# EasyEDA schematic 1-Schematic.json
TITLE: USB Port Protector; REV: 1.0; Date: 2018-06-15; Sheet: 1/1; Drawn By: tardate
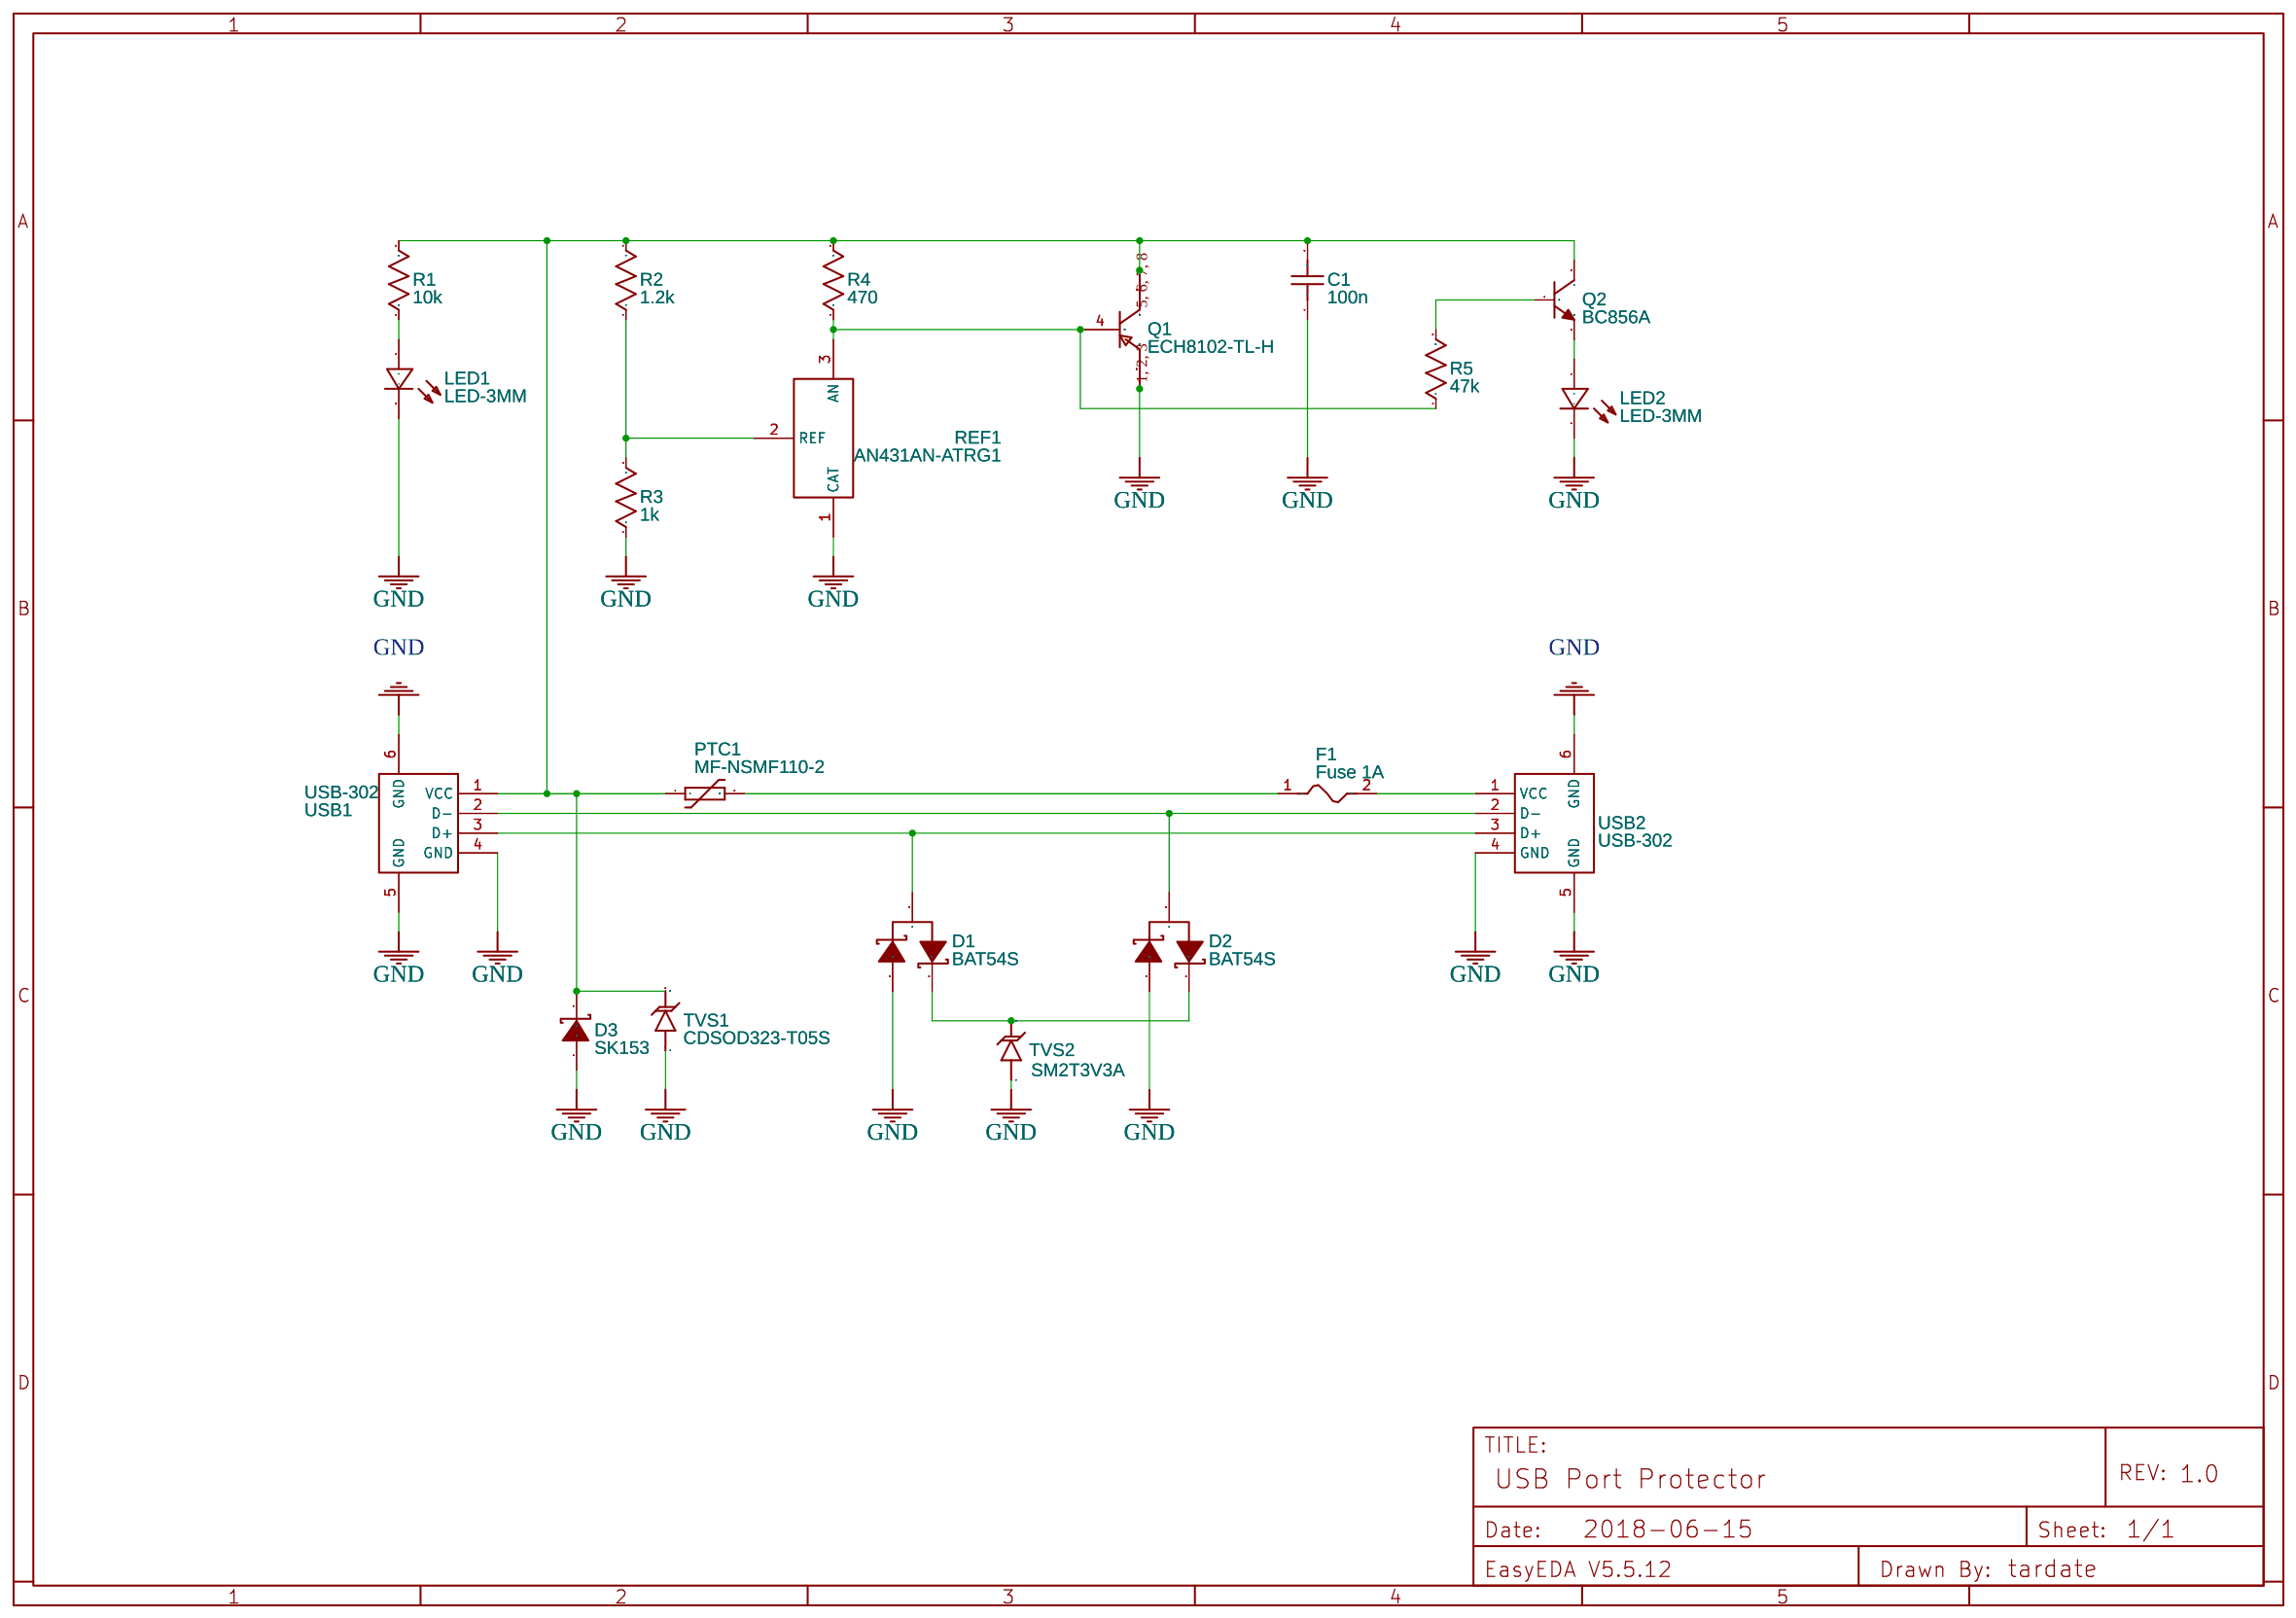
[diagram p0: schematic sheet]

## Parts
C1  100n  [RAD-0.1]
D1  BAT54S  [SOT-23(SOT-23-3)]
D2  BAT54S  [SOT-23(SOT-23-3)]
D3  SK153  [DO-16]
F1  Fuse 1A  [1206]
LED1  LED-3MM  [LED-3MM/2.54]
LED2  LED-3MM  [LED-3MM/2.54]
PTC1  MF-NSMF110-2  [PTC0805]
Q1  ECH8102-TL-H  [SOT23-8]
Q2  BC856A  [SOT-23(SOT-23-3)]
R1  10k  [AXIAL-0.3]
R2  1.2k  [AXIAL-0.3]
R3  1k  [AXIAL-0.3]
R4  470  [AXIAL-0.3]
R5  47k  [AXIAL-0.3]
REF1  AN431AN-ATRG1  [SOT-23(SOT-23-3)]
TVS1  CDSOD323-T05S  [SMC]
TVS2  SM2T3V3A  [SMC]
USB1  USB-302  [USB-302]
USB2  USB-302  [USB-302]

## Library data of the parts
C1 = Cap_RAD-0.1_US: Manufacturer Part: ?
D1 D2 = -: Supplier: LCSC; LCSC: C83935; Manufacturer: SEMTECH; image: //image.lceda.cn/szlcsc/C83935.jpg
D3 = Schottky: Manufacturer Part: ?
F1 = -: Supplier: LCSC; Manufacturer: BOURNS; Manufacturer Part: MF-NSMF110-2; LCSC: C89654
LED1 LED2 = -: Supplier: LCSC; Manufacturer: EVERLIGHT; Manufacturer Part: 204-10UYC/S530-A3
PTC1 = -: Resettable PTC; Contributor: DangerousPrototype; Manufacturer Part: ?
Q1 = -: Bipolar Transistor, -30 V, -12 A, Low VCE(sat), PNP Single, 8-Pin SOT-28FL, Pb-Free, Tape and Reel; Manufacturer Part: ?
Q2 = -: Supplier: LCSC; Manufacturer: CJ; LCSC: C8579; image: //image.lceda.cn/szlcsc/C8579.jpg
R1-R5 = Res_AXIAL-0.3(1/8W)_US: Manufacturer Part: ?
REF1 = -: Supplier: LCSC; Manufacturer: DIODES; LCSC: C97717
TVS1 TVS2 = -: Transient voltage suppressor- prevents ESD on inputs.; Contributor: SparkFun; Manufacturer Part: ?
USB1 USB2 = -: Supplier: LCSC; Manufacturer: SOFNG; LCSC: C112456

## Nets
GND: C1.1 D1.1(A1) D2.1(A1) D3.1(A) LED1.2(-) LED2.2(-) Q1.1(E) Q1.2(E) Q1.3(E) R3.1 REF1.1(CAT) TVS1.A TVS2.A USB1.4(GND) USB1.5(GND) USB1.6(GND) USB2.4(GND) USB2.5(GND) USB2.6(GND)
Net-(C1-2): C1.2 D3.2(K) PTC1.1 Q1.5(C) Q1.6(C) Q1.7(C) Q1.8(C) Q2.2(E) R1.2 R2.2 R4.2 TVS1.C USB1.1(VCC)
Net-(D1-2): D1.2(K2) D2.2(K2) TVS2.C
Net-(D1-3): D1.3(A) USB1.3(D+) USB2.3(D+)
Net-(D2-3): D2.3(A) USB1.2(D-) USB2.2(D-)
Net-(F1-1): F1.1 PTC1.2
Net-(F1-2): F1.2 USB2.1(VCC)
Net-(LED1-1): LED1.1(+) R1.1
Net-(LED2-1): LED2.1(+) Q2.3(C)
Net-(Q1-4): Q1.4(B) R4.1 R5.1 REF1.3(AN)
Net-(Q2-1): Q2.1(B) R5.2
Net-(R2-1): R2.1 R3.2 REF1.2(REF)
